# Altium schematic sheet PERIPHERALS.SchDoc
size A4; SheetNumber: 6; SheetTotal: 6
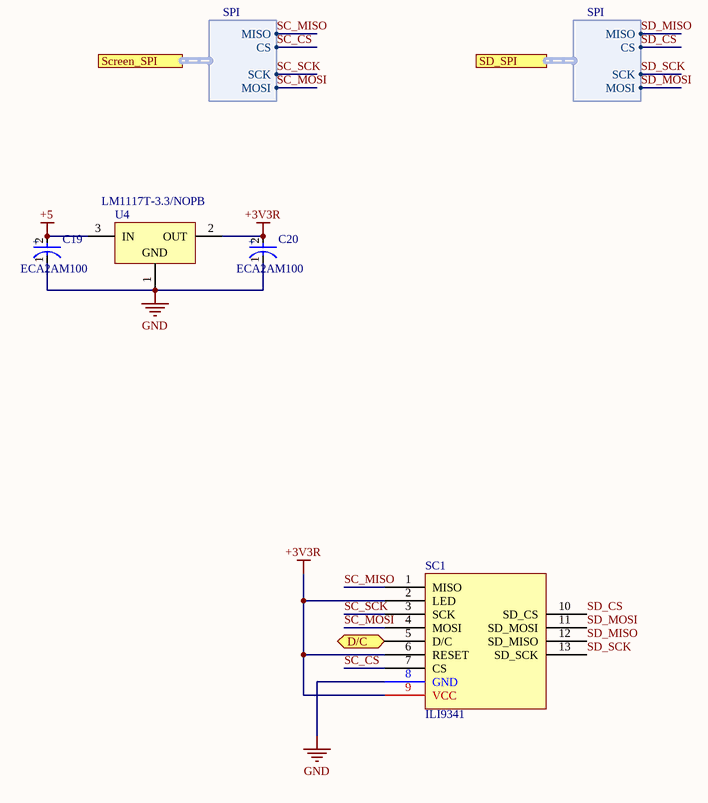
[diagram p0: PERIPHERALS.SchDoc]

## Parts
C19  ECA2AM100  [FP-RAD-TH-D_5_0_5-L_11_1-MFG]
C20  ECA2AM100  [FP-RAD-TH-D_5_0_5-L_11_1-MFG]
SC1  ILI9341  [ILI9341]
U4  LM1117T-3.3/NOPB  [NDE0003A]

## Ports
D/C (bidir, see Main[2B], MCU[2B]), Screen_SPI (harness SPI, see Main[2B], MCU[1B]), SD_SPI (harness SPI, see Main[2B], MCU[1B])

## Harnesses
SPI: MOSI, MISO, SCK, CS

## Nets
+3V3R: C20.2(A) SC1.2(LED) SC1.6(RESET) SC1.9(VCC) U4.2(OUT)
+5: C19.2(A) U4.3(IN)
GND: C19.1(C) C20.1(C) SC1.8(GND) U4.1(GND)
D/C: SC1.5(D/C) ; port D/C
SC_CS: SC1.7(CS) ; port Screen_SPI.CS
SC_MISO: SC1.1(MISO) ; port Screen_SPI.MISO
SC_MOSI: SC1.4(MOSI) ; port Screen_SPI.MOSI
SC_SCK: SC1.3(SCK) ; port Screen_SPI.SCK
SD_CS: SC1.10(SD_CS) ; port SD_SPI.CS
SD_MISO: SC1.12(SD_MISO) ; port SD_SPI.MISO
SD_MOSI: SC1.11(SD_MOSI) ; port SD_SPI.MOSI
SD_SCK: SC1.13(SD_SCK) ; port SD_SPI.SCK

## Notes on the sheet
- (in symbol CMP-05427-000869-1) +

## Library data of the parts
C19 C20 = CMP-05427-000869-1: Aluminum Electrolytic Capacitors (Radial Lead Type) 10uF ±20% 100V; Polarity: Polar; Lead Diameter: 0.5mm; Dissipation Factor: 0.1%; Leakage Current: 3uA; Dielectric Material: Aluminium; Ripple Current: 70mA; Life (Hours): 2000Hour; Lead/Base Style: Straight; Length: 11mm; Case/Package: Radial; Lead Pitch: 2mm; Contact Plating: Tin; RoHS Compliant: Yes; Radiation Hardening: No; Capacitance: 10uF; Max Operating Temperature: 85°C; Lead Free: Lead Free; Termination: Radial; Voltage Rating: 100V; Package Quantity: 200; Voltage: 100V; Construction: RADIAL; Height: 11mm; Min Operating Temperature: -40°C; Diameter: 5mm; REACH SVHC: No SVHC; Tolerance: 20%; Width: 5mm; Height - Seated (Max): 0.472inch; Mount: Through Hole; Series: M; Voltage Rating (DC): 100V; Packaging: Bulk; Ripple Current (AC): 70mA; Number of Pins: 2
U4 = CMP-0062-02494-3: 800mA Low-Dropout Linear Regulator, 3-pin TO-220, Pb-Free; Manufacturer: Texas Instruments; PackageTopMarking: NSUZXYTTE#*LM1117T*3.3; PowerWise: N; CompType: LDO IC; RoHS: Y; ComponentLink1URL: http://www.ti.com/general/docs/lit/getliterature.tsp?genericPartNumber=LM1117-N&fileType=pdf; PackageReference: NDE0003A; PinCount: 3; ComponentLink1Description: Datasheet URL; PackageDescription: TO-220, Molded, 3 Lead, Straight